# EAGLE design lipo_charger (EAGLE 9.2.0)
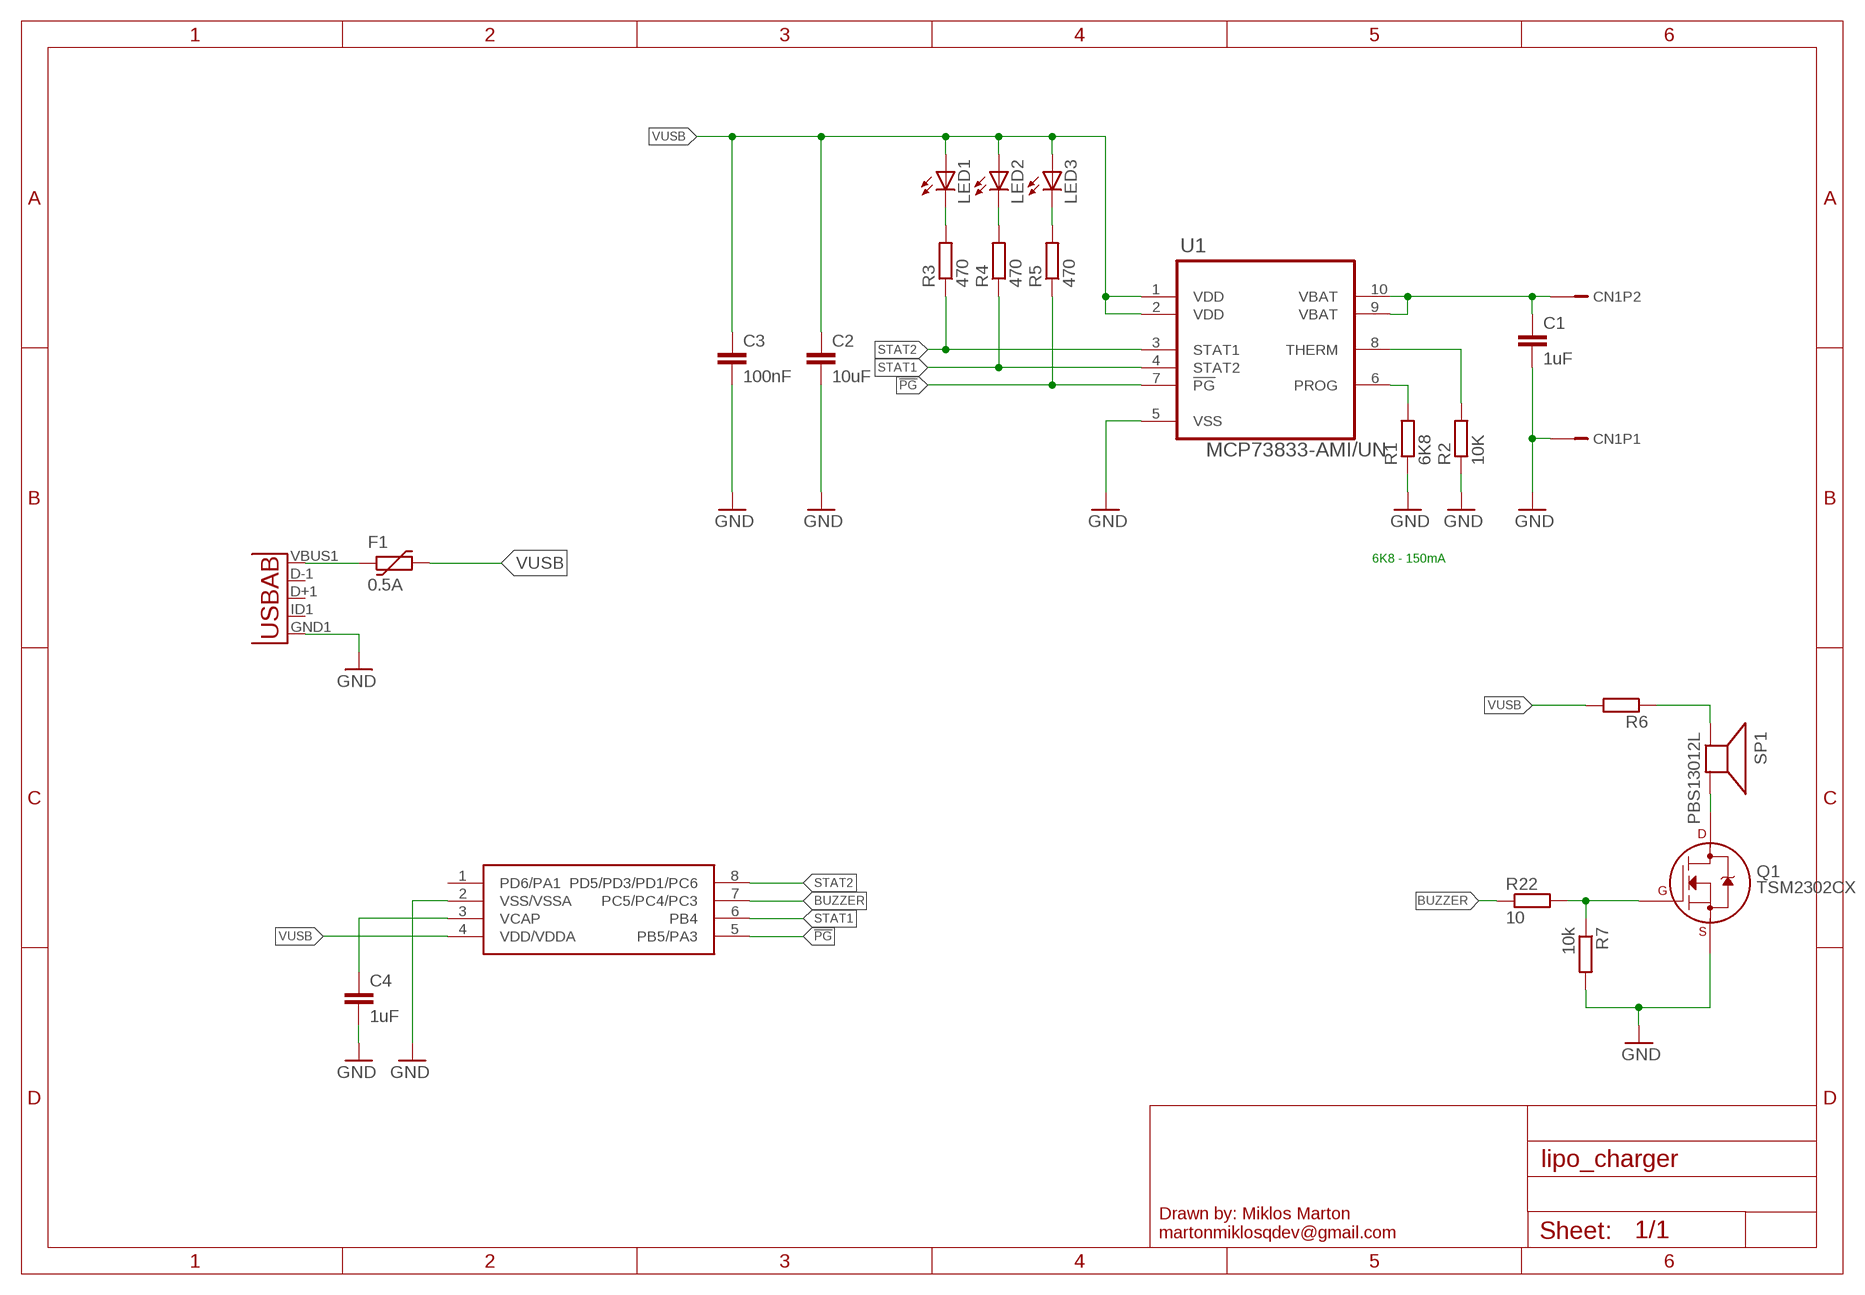
[diagram p0: schematic, sheet 1]

## Parts
C1  1uF  C-EUC0805  [C0805]
C2  10uF  C-EUC0805  [C0805]
C3  100nF  C-EUC0603  [C0603]
C4  1uF  C-EUC0603  [C0603]
CN1  B2B-PH-K-S  [B2B-PH-K-S]
F1  0.5A  FUSE_PTC-0805  [PTC0805]
LED1  LED0603  [CHIPLED_0603]
LED2  LED0603  [CHIPLED_0603]
LED3  LED0603  [CHIPLED_0603]
Q1  TSM2302CX  2N7002A_SOT23  [SOT-23]
R1  6K8  R-EU_R0603  [R0603]
R2  10K  R-EU_R0603  [R0603]
R3  470  R-EU_R0603  [R0603]
R4  470  R-EU_R0603  [R0603]
R5  470  R-EU_R0603  [R0603]
R6  R-EU_R0603  [R0603]
R7  10k  R-EU_R0603  [R0603]
R22  10  R-EU_R0603  [R0603]
SP1  PBS13012L  SPEAKER/AL60P  [AL60P]
U1  MCP73833-AMI/UN  [SOP50P490X110-10N]
U2  STM8S001J3  [SO8N]
X1  USB-ABIN&OUT  [USB-AB-MICRO-SMD-V03-IN&OUT]

## Nets
!PG: R5.1 U1.7(!PG) U2.5(PB5/PA3)
BUZZER: R22.1 U2.7(PC5/PC4/PC3)
BUZZER_BEFORERES: Q1.1(G) R7.1 R22.2
GND: C1.2 C2.2 C3.2 C4.2 CN1.1 Q1.2(S) R1.1 R2.1 R7.2 U1.5(VSS) U2.2(VSS/VSSA) X1.GND1(GND)
MCP73833_PROG: R1.2 U1.6(PROG)
MCP73833_THERM: R2.2 U1.8(THERM)
N$1: R6.1 SP1.1(+)
N$4: LED1.C R3.2
N$5: LED2.C R4.2
N$6: LED3.C R5.2
N$45: Q1.3(D) SP1.2(-)
STAT1: R4.1 U1.4(STAT2) U2.6(PB4)
STAT2: R3.1 U1.3(STAT1) U2.8(PD5/PD3/PD1/PC6)
VBAT: C1.1 CN1.2 U1.9(VBAT) U1.10(VBAT)
VCAP: C4.1 U2.3(VCAP)
VUSB: C2.1 C3.1 F1.2 LED1.A LED2.A LED3.A R6.2 U1.1(VDD) U1.2(VDD) U2.4(VDD/VDDA)
VUSB_UNFUSED: F1.1 X1.VBUS1(VBUS)
Unconnected: U2.1(PD6/PA1) X1.D+1(D+) X1.D-1(D-) X1.ID1(USBID)

## Notes on the sheet
- 6K8 - 150mA

## Library data of the parts
C1-C4 = rcl:C-EU: CAPACITOR, European symbol
CN1 = con-jst:B2B-PH-K-S; OC_TME: B2B-PH-K-S
F1 = dp_devices:FUSE_PTC: Resettable PTC; OC_TME: SR050-06
LED1-LED3 = CEDT:LED
Q1 = transistors:2N700*: 2N7000, 2N7002, NDS7002A N-channel enhancement mode MOSFET
R1-R7 R22 = rcl:R-EU_: RESISTOR, European symbol
SP1 = adafruit:SPEAKER: SPEAKER Source: Buerklin Added PS12 (for part # PS1240 piezo) http://www.ladyada.net/library/pcb/eaglelibrary.html; OC_LOMEX: 46-02-60
U1 = Microchip_By_element14_Batch_1:MCP73833-AMI/UN: IC, BATTERY CHARGER, 1A; MPN: MCP73833-AMI/UN; OC_FARNELL: 1332160; OC_NEWARK: 88K5664; OC_TME: MCP73833-AMI/UN; PACKAGE: MSOP-10; SUPPLIER: Microchip
U2 = STM8S001:STM8S001J3
X1 = Testing:USB-AB: This is a USB AB connector that is compatible with USB OTG. i.e. this connector can serve as a host or device

## Net classes
0 default: width 0.203 mm

## Board
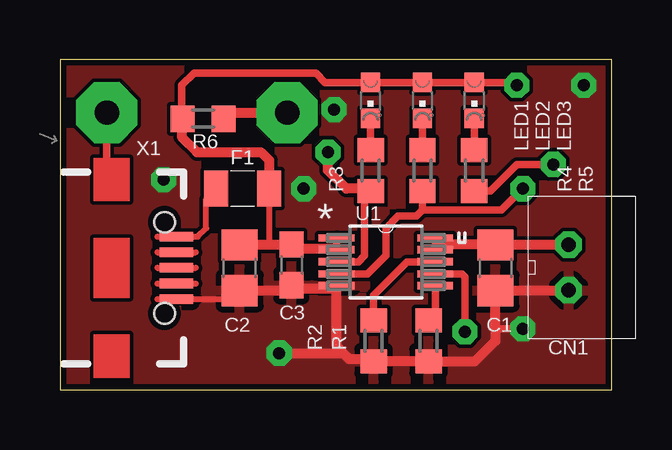
[diagram p1: board, top side]
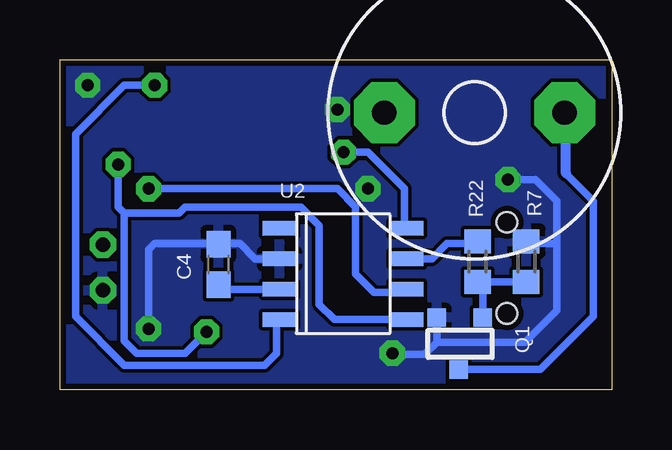
[diagram p2: board, bottom side, seen from below]

Size 23 x 13.75 mm. Coordinates in mm from the lower left corner, seen from the top.
Outline: 0,0 23,0 23,13.75 0,13.75 0,0
Copper layers (1*16): Top 0.035mm / dielectric 1.5mm / Bottom 0.035mm
Design rules "dirt_cheap_dirty_boards.v1": minimum track width 5mil, minimum drill 0.3mm, track to track 6mil, track to pad 6mil, pad to pad 6mil, via to via 6mil, smd to smd 0mil, copper to edge 10mil, drill to drill 10mil, minimum pad ring 10mil, minimum via ring 6mil, stop-mask expansion 2mil, vias tented up to drill 25mil, thermal gap 10mil

### Footprints (pad centres in the part's own frame; a part is rotated, then mirrored left to right if it is on the bottom)
C0805 = smd 1.3 x 1.5: 1 -0.95,0; 2 0.95,0
C0603 = smd 1.1 x 1: 1 -0.85,0; 2 0.85,0
B2B-PH-K-S = drill 0.6 pad 1.016 octagon: 1 1.95,0; 2 0.05,0
PTC0805 = smd 1 x 1.5: 1 -1.1,0; 2 1.1,0
CHIPLED_0603 = smd 0.8 x 0.8: A 0,-0.75; C 0,0.75
SOT-23 = smd 0.762 x 0.762: 1 -0.979,-1.101; 2 0.94,-1.101; 3 0.025,1.067
R0603 = smd 1 x 1.1: 1 -0.85,0; 2 0.85,0
AL60P = drill 1.016 pad 2.54 octagon: 1 -3.759,0; 2 3.759,0
SOP50P490X110-10N = smd 1.499 x 0.305: 1 -2.057,0.991; 2 -2.057,0.508; 3 -2.057,0; 4 -2.057,-0.508; 5 -2.057,-0.991; 6 2.057,-0.991; 7 2.057,-0.508; 8 2.057,0; 9 2.057,0.508; 10 2.057,0.991
SO8N = smd 0.6 x 1.4: 1 0,0; 2 1.27,0; 3 2.54,0; 4 3.81,0; 5 3.81,5.3; 6 2.54,5.3; 7 1.27,5.3; 8 0,5.3
USB-AB-MICRO-SMD-V03-IN&OUT = smd 1.4 x 0.4: D+1 2.7,0; D-1 2.7,0.65; GND1 2.7,-1.3; ID1 2.7,-0.65; VBUS1 2.7,1.3 | hole 0.85: 2.2,1.9; 2.2,-1.9

### Placement (x,y rotation side)
C1  18.16,5.08 270 top
C2  7.49,5.08 270 top
C3  9.65,5.21 270 top
C4  16.39,5.22 90 bottom
CN1  21.21,6.1 270 top
F1  7.62,8.38 0 top
LED1  12.95,12.06 180 top
LED2  15.11,12.06 180 top
LED3  17.27,12.06 180 top
Q1  6.35,1.91 180 bottom
R1  15.37,2.03 90 top
R2  13.08,2.03 90 top
R3  12.95,9.14 90 top
R4  15.11,9.14 90 top
R5  17.27,9.14 90 top
R6  5.97,11.3 180 top
R7  3.56,5.33 90 bottom
R22  5.59,5.33 270 bottom
SP1  5.71,11.56 0 bottom
U1  13.59,5.33 0 top
U2  13.84,6.73 270 bottom
X1  2.16,5.08 0 top

### Tracks (layer width: path | path; a pad name or v marks a point on that pad's centre or on a via)
!PG  (via drill 0.5 pad 1.05)
  Top 0.305: U1.7 16.76,4.83 16.89,4.7 v16.89,2.41 | R5.1 17.95,8.29 19.05,9.4 v20.57,9.4
  Bottom 0.305: U2.5 11.56,2.92 12.19,3.56 12.19,6.86 12.95,7.62 17.78,7.62 18.03,7.37 20.32,7.37 | 20.32,7.37 20.57,7.62 v20.57,9.4 | 17.02,2.29 v16.89,2.41 17.78,1.52 19.81,1.52 20.32,2.03 20.32,7.37
BUZZER
  Bottom 0.305: U2.7 7.49,5.46 6.86,6.1 5.84,6.1 | 5.84,6.1 5.69,6.1 | R22.1 5.75,6.18 5.84,6.1
BUZZER_BEFORERES
  Bottom 0.305: 5.37,4.48 Q1.1 | 5.37,4.48 R22.2 | R7.1 5.37,4.48
GND  (via drill 0.5 pad 1.05)
  Top 0.254: X1.GND1 7.49,3.78 C2.2
  Top 0.305: U1.5 11.53,4.22 11.56,3.81 | v19.3,2.54 18.16,2.54
  Top 0.406: 18.41,4.15 CN1.1 | 18.41,4.15 18.18,4.15 C1.2 | 18.41,4.15 18.16,3.89 18.16,2.54 18.16,2.03 17.31,1.18 R1.1 R2.1 12.99,1.27 12.06,1.27 11.81,1.52 | 11.81,1.52 11.53,1.8 11.53,4.22 9.79,4.22 C3.2 9.43,4.13 C2.2 | v9.14,1.52 11.81,1.52
  Bottom 0.305: 7.29,1.98 Q1.2 | 7.29,1.98 7.8,1.47 8.71,1.47 8.76,1.52 v9.14,1.52 | 3.43,6.31 R7.2 3.47,6.1 2.29,6.1 | U2.2 14.86,5.46 15.49,6.1 16.37,6.1 C4.2 16.41,6.1 19.05,6.1 19.3,5.84 v19.3,2.54 | 2.29,6.1 2.29,3.3 3.61,1.98 7.29,1.98 | v4.32,8.76 3.17,8.76 2.29,7.87 2.29,6.1
  other vias: 10.16,8.38 11.43,11.68 21.84,12.7
  pour Top: 0,13.72 0,0 23.11,0 23.11,13.72
  pour Bottom: 0,13.72 0,0 23.11,0 23.11,13.72
MCP73833_PROG
  Top 0.305: R1.2 15.65,3.16 U1.6
MCP73833_THERM
  Top 0.305: U1.8 14.48,5.33 13.08,3.94 R2.2
N$1
  Top 0.406: R6.1 7.07,11.56 SP1.1
N$4
  Top 0.305: LED1.C R3.2
N$5
  Top 0.305: LED2.C R4.2
N$6
  Top 0.305: R5.2 LED3.C
N$45
  Top 0.305: 1.96,9.07 SP1.2
  Bottom 0.305: Q1.3 2.97,0.84 0.76,3.05 0.76,7.87 1.91,9.02 1.96,9.07
  Bottom 0.406: 1.91,9.02 1.91,11.51 SP1.2
STAT1  (via drill 0.5 pad 1.05)
  Top 0.305: U1.4 12.83,4.83 13.59,5.59 13.59,6.73 14.1,7.24 14.86,7.24 15.11,7.49 | R4.1 15.11,7.49 | 15.11,7.49 16.59,7.49 16.6,7.49 18.41,7.49 v19.3,8.38
  Bottom 0.305: U2.6 8.67,4.06 9.91,4.06 10.67,4.83 10.67,7.62 11.43,8.38 v19.3,8.38
STAT2  (via drill 0.5 pad 1.05)
  Top 0.305: U1.3 12.45,5.33 12.7,5.59 12.7,8.04 R3.1
  Top 0.406: R3.1 12.87,8.38 11.94,8.38 11.18,9.14 v11.18,9.91
  Bottom 0.305: U2.8 8.64,6.82 8.64,8.38 10.16,9.91 v11.18,9.91
VBAT
  Top 0.305: U1.10 U1.9 15.7,5.89
  Top 0.406: 18.16,6.05 CN1.2 | 18.16,6.05 15.85,6.05 15.7,5.89 | C1.1 18.16,6.05
VCAP
  Bottom 0.305: C4.1 16.21,4.19 U2.3
VUSB  (via drill 0.5 pad 1.05)
  Top 0.254: F1.2 8.72,6.06 C3.1
  Top 0.305: U1.2 11.53,5.89 U1.1 11.56,6.35 | 5.08,11.26 5.08,12.7 5.59,13.21 10.67,13.21 11.06,12.81 LED1.A LED2.A LED3.A 18.93,12.81 v19.05,12.7
  Top 0.406: C2.1 9.62,6.03 C3.1 9.82,5.89 11.53,5.89 | R6.2 5.08,11.26 5.08,10.54 5.71,9.91 8.38,9.91 8.72,9.57 F1.2
  Bottom 0.305: U2.4 13.97,2.79 13.97,1.52 14.48,1.02 20.32,1.02 22.35,3.05 22.35,10.67 20.32,12.7 v19.05,12.7
VUSB_UNFUSED
  Top 0.254: X1.VBUS1 5.75,6.38 6.1,6.73 6.1,7.96 F1.1